# EAGLE schematic MPU9250_and_TMP102 (EAGLE 8.3.2)
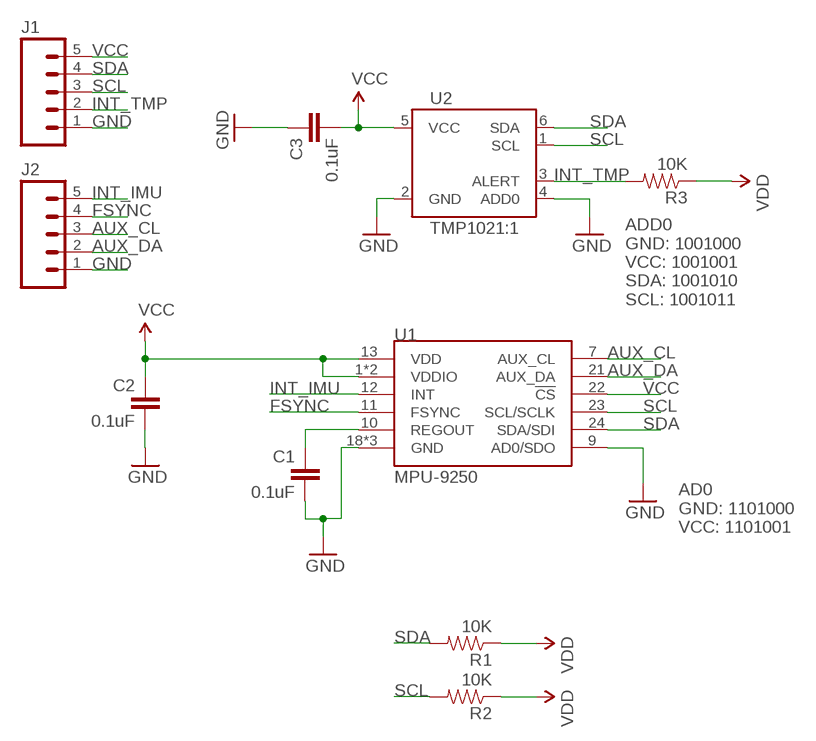
[diagram p0: schematic, sheet 1]

## Parts
C1  0.1uF  0.1UF-25V(+80/-20%)(0603)  [0603-CAP]
C2  0.1uF  0.1UF-25V(+80/-20%)(0603)  [0603-CAP]
C3  0.1uF  0.1UF-25V(+80/-20%)(0603)  [0603-CAP]
J1  M05PTH  [1X05]
J2  M05PTH  [1X05]
R1  10K  10KOHM-1/10W-1%(0603)0603  [0603-RES]
R2  10K  10KOHM-1/10W-1%(0603)0603  [0603-RES]
R3  10K  10KOHM-1/10W-1%(0603)0603  [0603-RES]
U1  MPU-9250  [QFN24_PAD]
U2  TMP1021:1  [SOT563-2]

## Nets
AUX_CL: J2.3 U1.7(AUX_CL)
AUX_DA: J2.2 U1.21(AUX_DA)
FSYNC: J2.4 U1.11(FSYNC)
GND: C1.2 C2.2 C3.1 J1.1 J2.1 U1.9(AD0/SDO) U1.18(GND) U1.20(GND) U1.CENTER(GND) U2.2(GND) U2.4(ADD0)
INT_IMU: J2.5 U1.12(INT)
INT_TMP: J1.2 R3.2 U2.3(ALERT)
REGOUT: C1.1 U1.10(REGOUT)
SCL: J1.3 R2.2 U1.23(SCL/SCLK) U2.1(SCL)
SDA: J1.4 R1.2 U1.24(SDA/SDI) U2.6(SDA)
VCC: C2.1 C3.2 J1.5 R1.1 R2.1 R3.1 U1.1(VDDIO) U1.8(VDDIO) U1.13(VDD) U1.22(!CS) U2.5(VCC) ; supply symbol labelled VDD

## Notes on the sheet
- ADD0
  GND: 1001000
  VCC: 1001001
  SDA: 1001010
  SCL: 1001011
- AD0
  GND: 1101000
  VCC: 1101001

## Library data of the parts
C1-C3 = SparkFun-Capacitors:0.1UF-25V(+80/-20%)(0603): CAP-00810 Ceramic Standard decoupling cap; PROD_ID: CAP-00810
J1 J2 = SparkFun-Connectors:M05: Header 5 Standard 5-pin 0.1" header. Use with straight break away headers (SKU : PRT-00116), right angle break away headers (PRT-00553), swiss pins (PRT-00743), machine pins (PRT-00117), and female headers (PRT-00115). Molex polarized connector foot print use with SKU : PRT-08230 with associated crimp pins and housings.
R1-R3 = SparkFun-Resistors:10KOHM-1/10W-1%(0603): RES-00824; PROD_ID: RES-00824
U1 = Testing:MPU-9250: NC pin 19. 2-6 & 14-17 not internally connected. May be used for PCB trace routing.; PROD_ID: IC-13192
U2 = SparkFun-Sensors:TMP102: I2C degC temp sensor